# Altium schematic sheet PowerSupply.SchDoc
size A; SheetNumber: 2; SheetTotal: 4
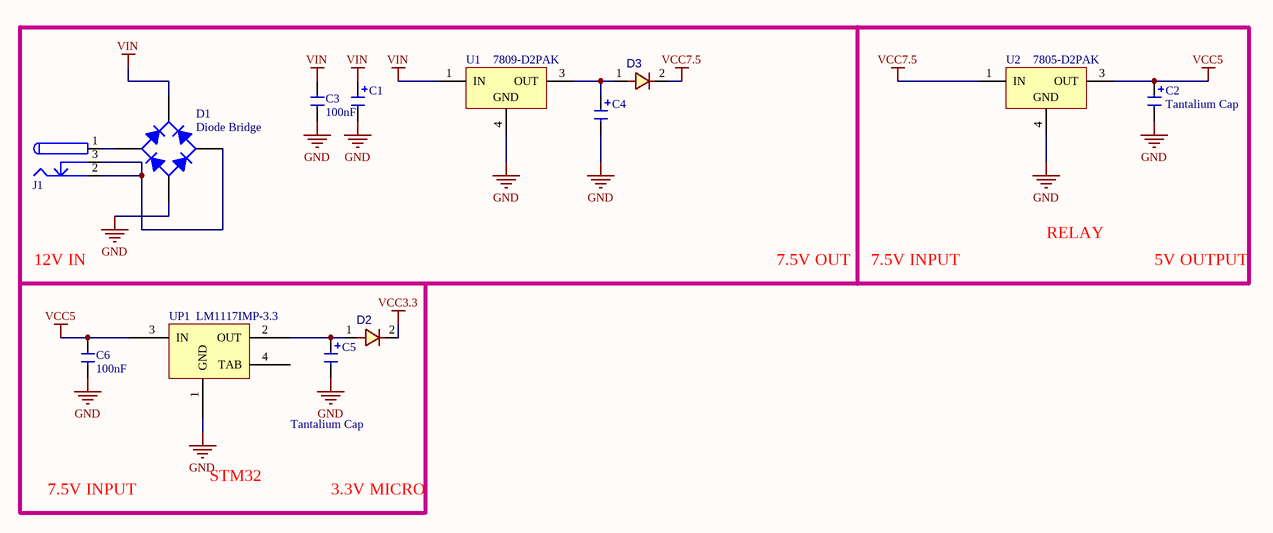
[diagram p0: PowerSupply.SchDoc]

## Parts
C1  (no value)  [CAPACITOR RADIAL SMT size F]
C2  Tantalium Cap  [Tantalium Size B]
C3  Capacitor SMD  [1206 Capacitor]  (value not drawn)
C4  (no value)  [CAPACITOR RADIAL SMT size F]
C5  Tantalium Cap  [Tantalium Size B]
C6  Capacitor SMD  [1206 Capacitor]  (value not drawn)
D1  Diode Bridge  [Bridge Circle Package]
D2  (no value)  [D_SOD80]
D3  (no value)  [D_SOD80]
J1  DC Power Jack  [DC Power Jack 1]  (value not drawn)
U1  7809-D2PAK  [D2PAK TO-263]
U2  7805-D2PAK  [D2PAK TO-263]
UP1  value LM1117IMP-3.3  [SOT223_4]  (hidden comment: LM1117IMP-5.0)

## Nets
GND: C1.2 C2.2 C3.1 C4.2 C5.2 C6.1 D1.3(AC) U1.4(GND) U2.4(GND) UP1.1(GND)
VCC3.3: D2.2
VCC5: C2.1 C6.2 U2.3(OUT) UP1.3(IN)
VCC7.5: D3.2 U2.1(IN)
VIN: C1.1 C3.2 D1.1(+) U1.1(IN)
NetC4_1: C4.1 D3.1 U1.3(OUT)
NetC5_1: C5.1 D2.1 UP1.2(OUT)
NetD1_2: D1.2(AC) J1.1
NetD1_4: D1.4(-) J1.2 J1.3

Not connected (* = marked no-connect by the designer): UP1 4(TAB)

## Notes on the sheet
- 12V IN
- 7.5V OUT
- 7.5V INPUT
- RELAY
- 5V OUTPUT
- STM32
- 3.3V MICRO
- (in symbol Capacitor SMD) 100nF

## Library data of the parts
C1 C2 C4 C5 = Capacitor Tantalium
D1 = Diode Bridge TOTAL SIZE: Full Wave Diode Bridge; Designer: Abbas Basereh; Design Date: 1395/11/09; ComponentLink1Description: Datasheet; ComponentLink2Description: Reference; Mounting Technology: Surface Mount\Through-Hole; Status: Unreleased
D2 D3 = DIODE_SMD_1N4148_SOD80: DIODE, FAST SWTICHING, 0.3A, 0.5W; DESC: DESCRIPTION; PARAM: 75V; PARAM2: 300mA, 0.5W; MANF_P#: 1N4148; MANF: MANF; ASSEMBLY: ASSEMBLY; PRICE: PRICE
J1 = DC Power Jack: DC Power Jack. Center Pin 2.5mm. Diameter: 5.7mm; Designer: Ali Hafizi; Company: Personal; Project Name: Laser; Adding Date: 10/21/2009
U1 = 7805-D2PAK
UP1 = LM1117IMP-x.x: x.x Volt, 800mA Low-Dropout Linear Regulator, 4-pin SOT-223; Designer: Abbas Basereh; Data: 16-12-2016